# Altium schematic sheet IGresupply2-2.SchDoc
size A4
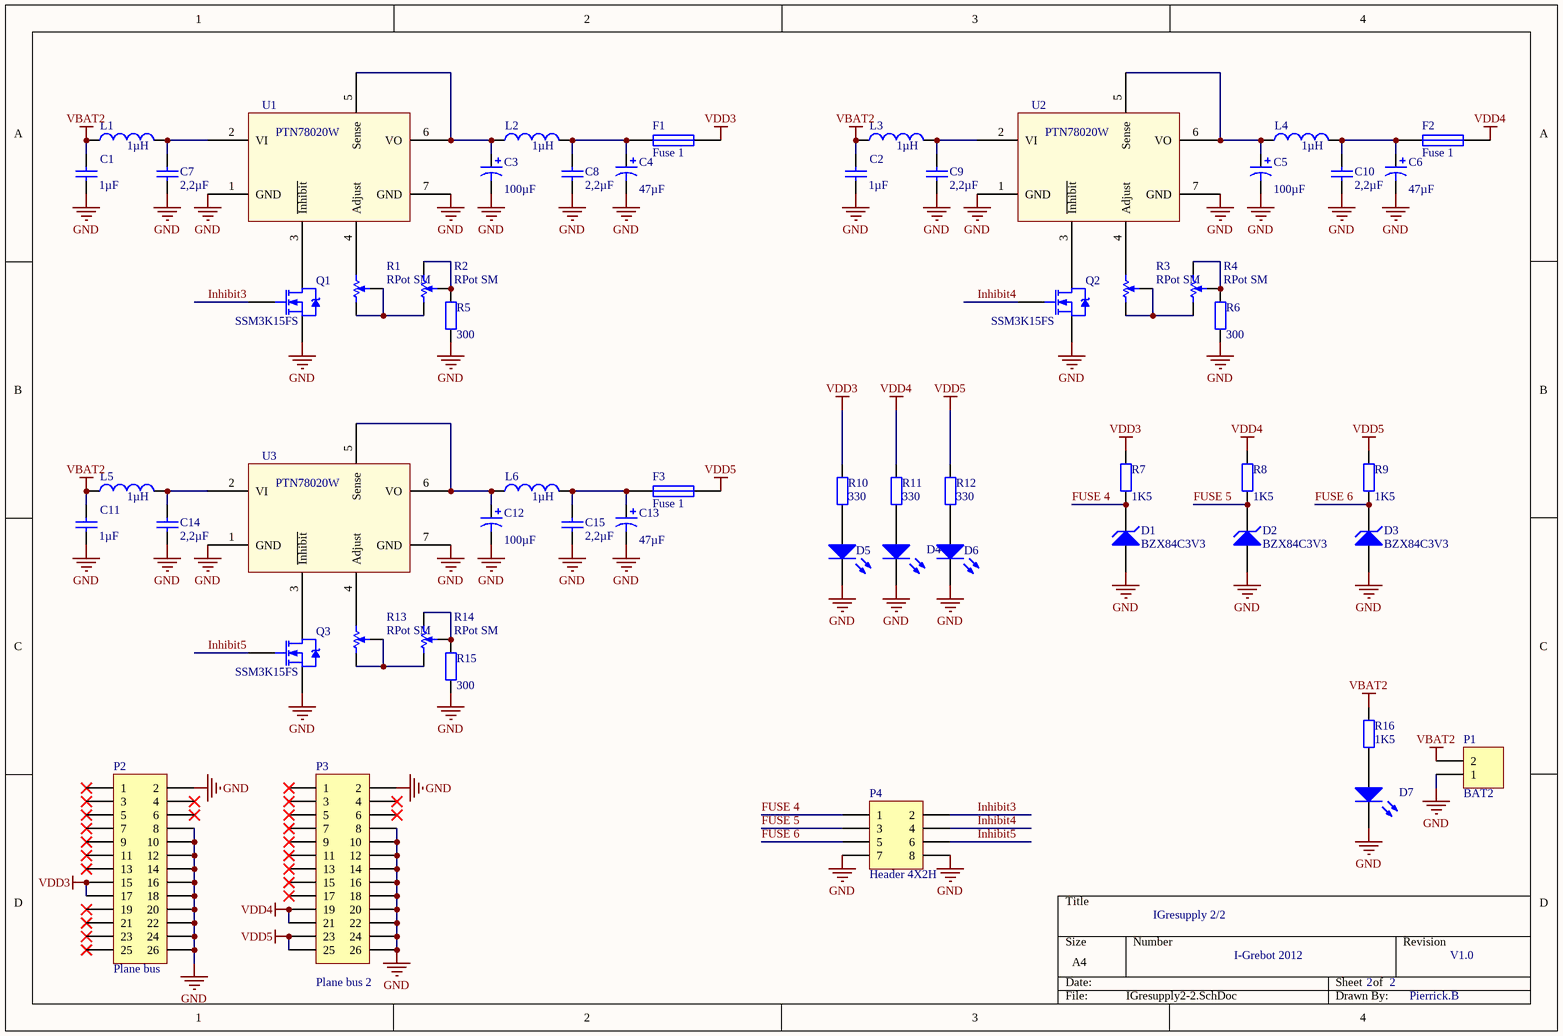
[diagram p0: IGresupply2-2.SchDoc]

## Parts
C1  value 1µF  [Boitier tantale A]  (hidden comment: Cap)
C2  value 1µF  [Boitier tantale A]  (hidden comment: Cap)
C3  value 100µF  [Boitier tantale C]  (hidden comment: Cap Pol)
C4  value 47µF  [Boitier tantale C]  (hidden comment: Cap Pol)
C5  value 100µF  [Boitier tantale C]  (hidden comment: Cap Pol)
C6  value 47µF  [Boitier tantale C]  (hidden comment: Cap Pol)
C7  value 2,2µF  [Boitier tantale A]  (hidden comment: Cap)
C8  value 2,2µF  [Boitier tantale A]  (hidden comment: Cap)
C9  value 2,2µF  [Boitier tantale A]  (hidden comment: Cap)
C10  value 2,2µF  [Boitier tantale A]  (hidden comment: Cap)
C11  value 1µF  [Boitier tantale A]  (hidden comment: Cap)
C12  value 100µF  [Boitier tantale C]  (hidden comment: Cap Pol)
C13  value 47µF  [Boitier tantale C]  (hidden comment: Cap Pol)
C14  value 2,2µF  [Boitier tantale A]  (hidden comment: Cap)
C15  value 2,2µF  [Boitier tantale A]  (hidden comment: Cap)
D1  BZX84C3V3  [SOT-23]
D2  BZX84C3V3  [SOT-23]
D3  BZX84C3V3  [SOT-23]
D4  LED1  [HSMS-C110]  (value not drawn)
D5  LED1  [HSMS-C110]  (value not drawn)
D6  LED1  [HSMS-C110]  (value not drawn)
D7  LED1  [HSMS-C110]  (value not drawn)
F1  Fuse 1  [MCCQ-122]
F2  Fuse 1  [MCCQ-122]
F3  Fuse 1  [MCCQ-122]
L1  value 1µH  [744772010]  (hidden comment: Inductor)
L2  value 1µH  [744772010]  (hidden comment: Inductor)
L3  value 1µH  [744772010]  (hidden comment: Inductor)
L4  value 1µH  [744772010]  (hidden comment: Inductor)
L5  value 1µH  [744772010]  (hidden comment: Inductor)
L6  value 1µH  [744772010]  (hidden comment: Inductor)
P1  BAT2  [SL 5.08/90]
P2  Plane bus  [HDR2X13H]
P3  Plane bus 2  [HDR2X13H]
P4  Header 4X2H  [HDR2X4H]
Q1  SSM3K15FS  [SOT-23]
Q2  SSM3K15FS  [SOT-23]
Q3  SSM3K15FS  [SOT-23]
R1  RPot SM  [3296X]
R2  RPot SM  [3296X]
R3  RPot SM  [3296X]
R4  RPot SM  [3296X]
R5  value 300  [0805]  (hidden comment: Res2)
R6  value 300  [0805]  (hidden comment: Res2)
R7  value 1K5  [0805]  (hidden comment: Res2)
R8  value 1K5  [0805]  (hidden comment: Res2)
R9  value 1K5  [0805]  (hidden comment: Res2)
R10  value 330  [0805]  (hidden comment: Res2)
R11  value 330  [0805]  (hidden comment: Res2)
R12  value 330  [0805]  (hidden comment: Res2)
R13  RPot SM  [3296X]
R14  RPot SM  [3296X]
R15  value 300  [0805]  (hidden comment: Res2)
R16  value 1K5  [0805]  (hidden comment: Res2)
U1  PTN78020W  [EUK]
U2  PTN78020W  [EUK]
U3  PTN78020W  [EUK]

## Nets
GND: C1.1 C2.1 C3.2 C4.2 C5.2 C6.2 C7.1 C8.1 C9.1 C10.1 C11.1 C12.2 C13.2 C14.1 C15.1 D1.1(A) D2.1(A) D3.1(A) D4.2(K) D5.2(K) D6.2(K) D7.2(K) P1.1 P2.2 P2.8 P2.10 P2.12 P2.14 P2.16 P2.18 P2.20 P2.22 P2.24 P2.26 P3.2 P3.8 P3.10 P3.12 P3.14 P3.16 P3.18 P3.20 P3.22 P3.24 P3.26 P4.7 P4.8 Q1.3(S) Q2.3(S) Q3.3(S) R5.1 R6.1 R15.1 U1.1(GND) U1.7(GND) U2.1(GND) U2.7(GND) U3.1(GND) U3.7(GND)
VBAT2: C1.2 C2.2 C11.2 L1.1 L3.1 L5.1 P1.2 R16.2
VDD3: F1.2 P2.15 P2.17 R7.2 R10.2
VDD4: F2.2 P3.19 P3.21 R8.2 R11.2
VDD5: F3.2 P3.23 P3.25 R9.2 R12.2
FUSE 4: D1.3(K) P4.1 R7.1
FUSE 5: D2.3(K) P4.3 R8.1
FUSE 6: D3.3(K) P4.5 R9.1
Inhibit3: P4.2 Q1.1(G)
Inhibit4: P4.4 Q2.1(G)
Inhibit5: P4.6 Q3.1(G)
NetC3_1: C3.1 L2.1 U1.5(Sense) U1.6(VO)
NetC4_1: C4.1 C8.2 F1.1 L2.2
NetC5_1: C5.1 L4.1 U2.5(Sense) U2.6(VO)
NetC6_1: C6.1 C10.2 F2.1 L4.2
NetC7_2: C7.2 L1.2 U1.2(VI)
NetC9_2: C9.2 L3.2 U2.2(VI)
NetC12_1: C12.1 L6.1 U3.5(Sense) U3.6(VO)
NetC13_1: C13.1 C15.2 F3.1 L6.2
NetC14_2: C14.2 L5.2 U3.2(VI)
NetD4_1: D4.1(A) R11.1
NetD5_1: D5.1(A) R10.1
NetD6_1: D6.1(A) R12.1
NetD7_1: D7.1(A) R16.1
NetQ1_2: Q1.2(D) U1.3(~{Inhibit})
NetQ2_2: Q2.2(D) U2.3(~{Inhibit})
NetQ3_2: Q3.2(D) U3.3(~{Inhibit})
NetR1_1: R1.1(-) R1.2(W) R2.1(-)
NetR1_3: R1.3(+) U1.4(Adjust)
NetR2_2: R2.2(W) R2.3(+) R5.2
NetR3_1: R3.1(-) R3.2(W) R4.1(-)
NetR3_3: R3.3(+) U2.4(Adjust)
NetR4_2: R4.2(W) R4.3(+) R6.2
NetR13_1: R13.1(-) R13.2(W) R14.1(-)
NetR13_3: R13.3(+) U3.4(Adjust)
NetR14_2: R14.2(W) R14.3(+) R15.2

Not connected (* = marked no-connect by the designer): P2 1* 3* 4* 5* 6* 7* 9* 11* 13* 19* 21* 23* 25*; P3 1* 3* 4* 5* 6* 7* 9* 11* 13* 15* 17*

## Notes on the sheet
- IGresupply 2/2
- I-Grebot 2012
- 2
- V1.0
- Pierrick.B

## Library data of the parts
C1 C2 C7-C11 C14 C15 = Cap: Capacitor; Published: 8-Jun-2000; LatestRevisionDate: 17-Jul-2002; LatestRevisionNote: Re-released for DXP Platform.; PackageReference: RAD-0.3; Publisher: Altium Limited; Supplier: FARNELL
C3-C6 C12 C13 = Cap Pol: Polarized Capacitor; Published: 8-Jun-2000; LatestRevisionDate: 17-Jul-2002; LatestRevisionNote: Re-released for DXP Platform.; PackageReference: POLAR0.8; Publisher: Altium Limited; Supplier: FARNELL
D1-D3 = D Zener: Zener Diode; Published: 8-Jun-2000; LatestRevisionDate: 17-Jul-2002; LatestRevisionNote: Re-released for DXP Platform.; PackageReference: DIODE-0.7; Publisher: Altium Limited
D4-D7 = LED1: Typical RED GaAs LED; Published: 8-Jun-2000; LatestRevisionDate: 08-Jul-2005; LatestRevisionNote: Mech Layer 1 removed.; PackageReference: LED-1; Publisher: Altium Limited
F1-F3 = Fuse 1: Fuse; Published: 8-Jun-2000; LatestRevisionDate: 17-Jul-2002; LatestRevisionNote: Re-released for DXP Platform.; PackageReference: PIN-W2/E2.8; Publisher: Altium Limited
L1-L6 = Inductor: Code_IEC: 1005; Published: 8-Jun-2000; LatestRevisionDate: 17-Jul-2002; LatestRevisionNote: Re-released for DXP Platform.; PackageReference: 0402-A; Publisher: Altium Limited; Code_JEITA: 0402
P1 = 0436500203: Micro-Fit, 3.0; LatestRevisionDate: 17-Jul-2002; LatestRevisionNote: Re-released for DXP Platform.; Publisher: Altium Limited
P2 P3 = Header 13X2H: Header, 13-Pin, Dual row, Right Angle; LatestRevisionDate: 17-Jul-2002; LatestRevisionNote: Re-released for DXP Platform.; Publisher: Altium Limited
P4 = Header 4X2H: Header, 4-Pin, Dual row, Right Angle; LatestRevisionDate: 17-Jul-2002; LatestRevisionNote: Re-released for DXP Platform.; Publisher: Altium Limited
Q1-Q3 = NMOS-2: N-Channel Power MOSFET; Note: Pin 2 is electrically connected to pin 4.; Published: 8-Jun-2000; LatestRevisionDate: 17-Jul-2002; LatestRevisionNote: Re-released for DXP Platform.; DatasheetDocument: PD-9.814; PackageReference: TO-220AB; Publisher: Altium Limited; Code_JEDEC: TO-220-AB; ComponentLink1Description: Manufacturer Link; ComponentLink1URL: http://www.irf.com/
R1-R4 R13 R14 = RPot SM: Square Trimming Potentiometer; Published: 17-Dec-2003; DatasheetDocument: Oct-2003; PackageReference: POT4MM-2; Publisher: Altium Limited; ComponentLink1Description: Manufacturer Link; ComponentLink1URL: http://bourns.com/2/search.html
R5-R12 R15 R16 = Res2: Resistor; Published: 8-Jun-2000; LatestRevisionDate: 17-Jul-2002; LatestRevisionNote: Re-released for DXP Platform.; PackageReference: AXIAL-0.4; Publisher: Altium Limited
  R5-R9 R15: Supplier: FARNELL